# Altium project foxbms2-master.PrjPcb (part 5 of 8)

## Sheet supply.SchDoc
size A3; DocumentNumber: 41; SheetNumber: 41; SheetTotal: 45; SheetDescription: Board Power Supply
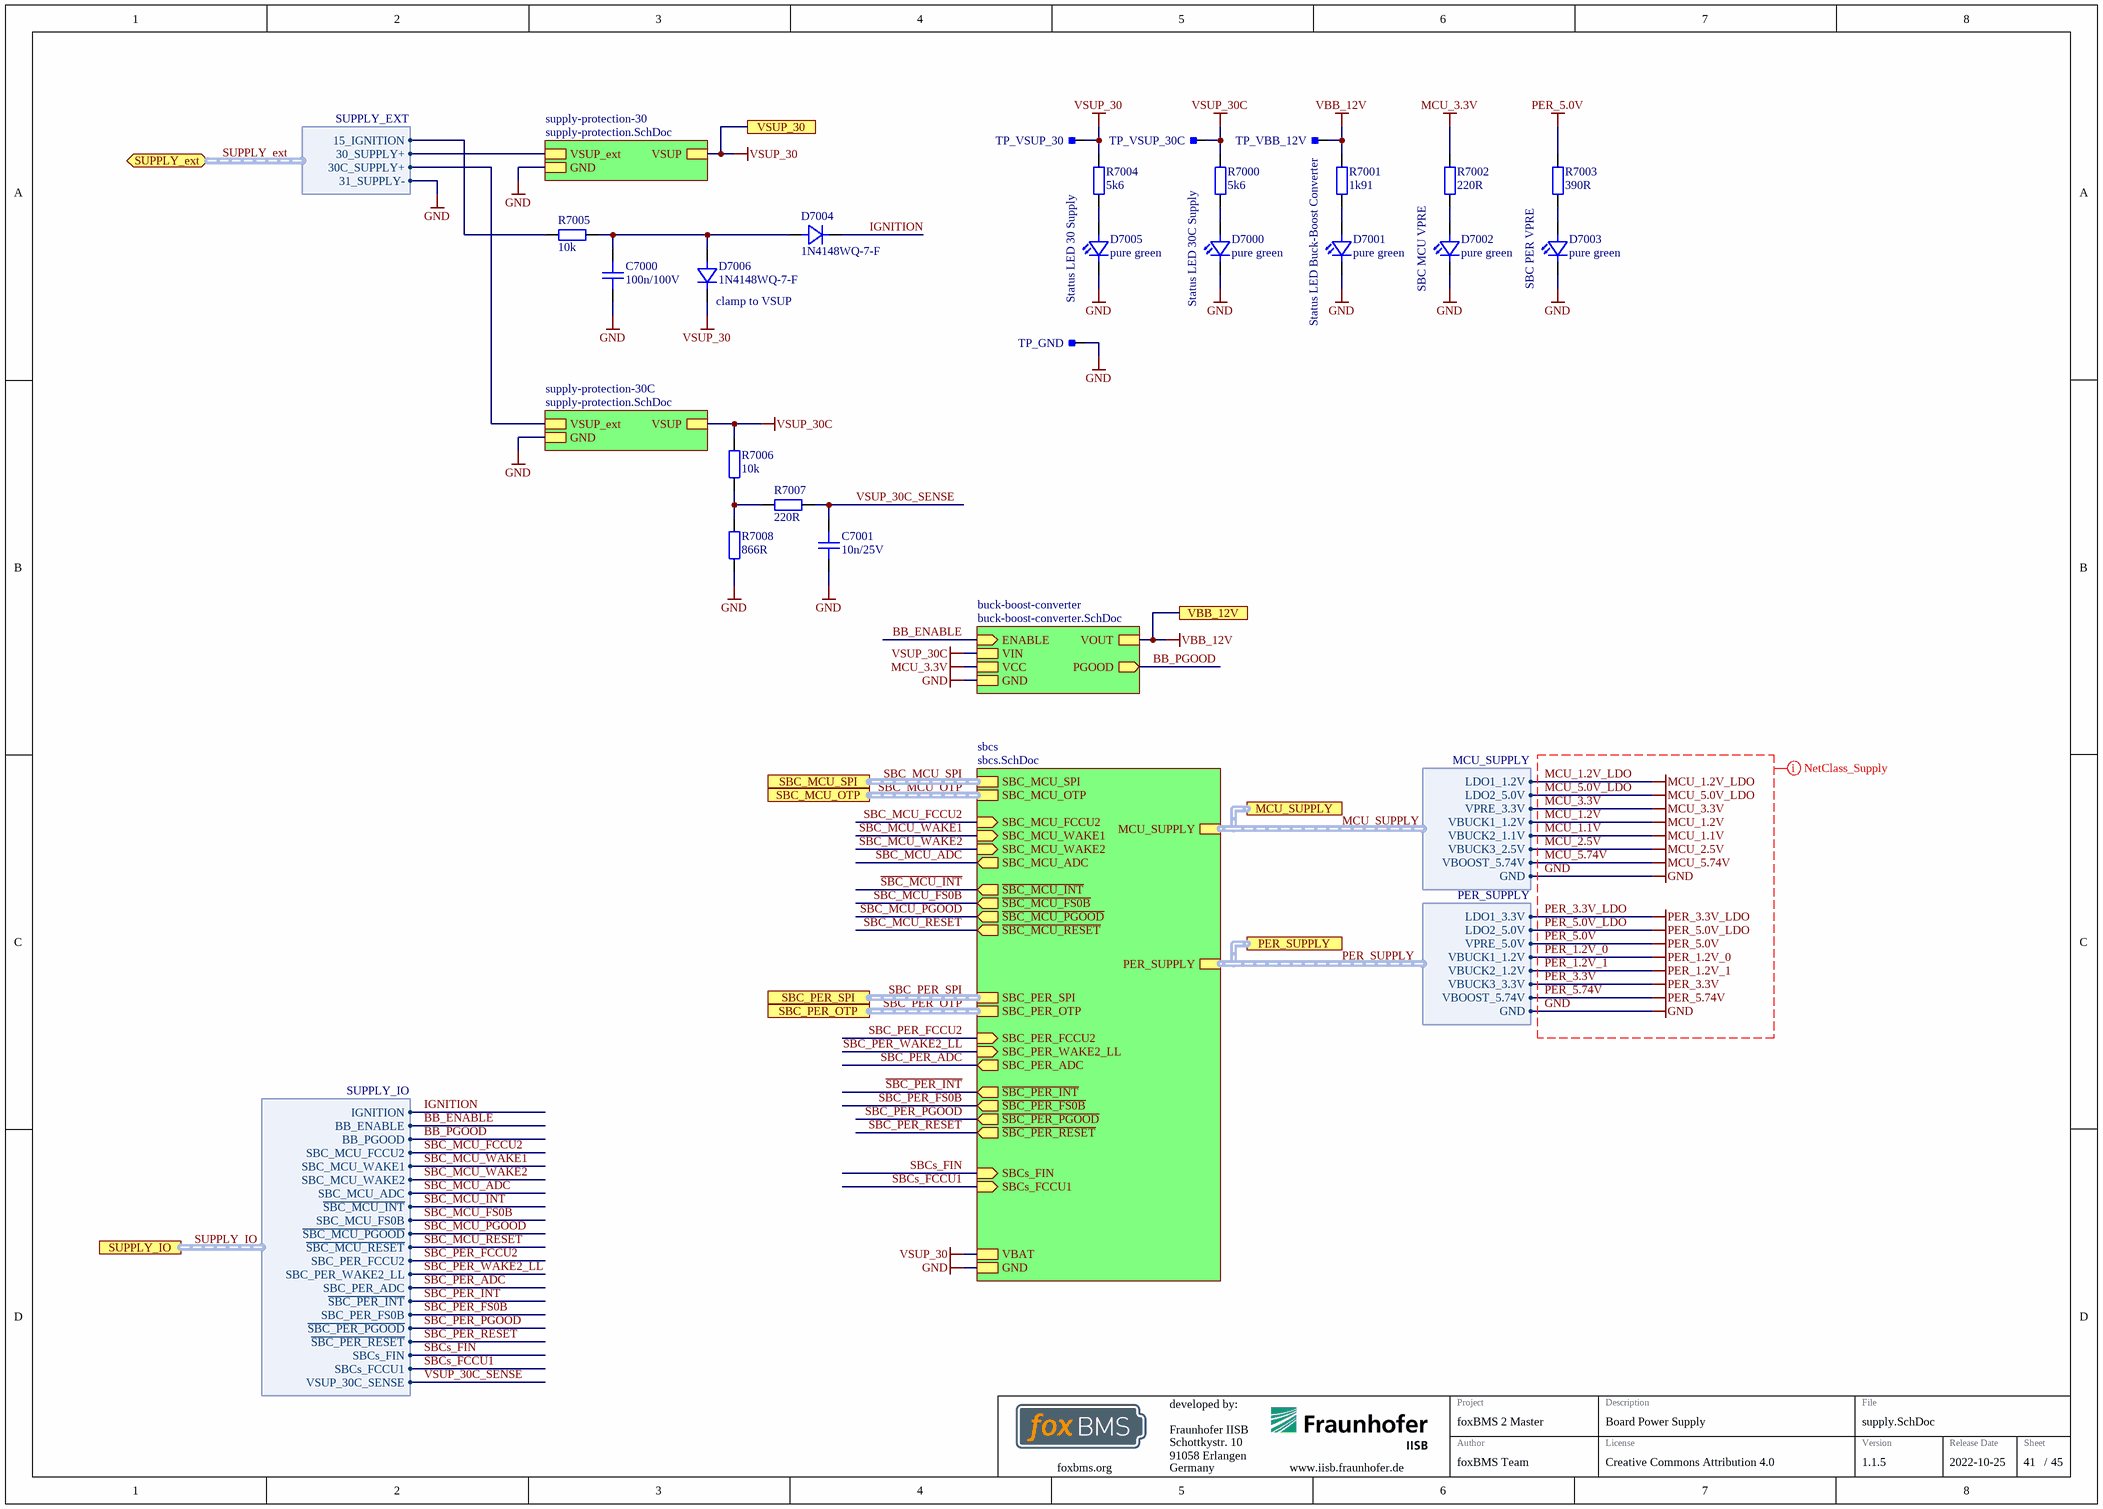
[diagram p37: supply.SchDoc]

### Parts
C7000  100n/100V  [CAPC1608X08N]
C7001  10n/25V  [CAPC1005X06N]
D7000  pure green  [LEDC1608X07N]
D7001  pure green  [LEDC1608X07N]
D7002  pure green  [LEDC1608X07N]
D7003  pure green  [LEDC1608X07N]
D7004  1N4148WQ-7-F  [SOD-123_CASE-425-04-ISSUE-G]
D7005  pure green  [LEDC1608X07N]
D7006  1N4148WQ-7-F  [SOD-123_CASE-425-04-ISSUE-G]
R7000  5k6  [RESC1005X04N]
R7001  1k91  [RESC1005X04N]
R7002  220R  [RESC1005X04N]
R7003  390R  [RESC1005X04N]
R7004  5k6  [RESC1005X04N]
R7005  10k  [RESC1005X04N]
R7006  10k  [RESC1005X04N]
R7007  220R  [RESC1005X04N]
R7008  866R  [RESC1005X04N]
TP_GND  Testpoint_Square  [Testpoint_S1]  (value not drawn)  (no BOM)
TP_VBB_12V  Testpoint_Square  [Testpoint_S1]  (value not drawn)  (no BOM)
TP_VSUP_30  Testpoint_Square  [Testpoint_S1]  (value not drawn)  (no BOM)
TP_VSUP_30C  Testpoint_Square  [Testpoint_S1]  (value not drawn)  (no BOM)

### Sub-sheets
buck-boost-converter = buck-boost-converter.SchDoc: VIN, VOUT, PGOOD (out), GND, VCC, ENABLE (in)
sbcs = sbcs.SchDoc: VBAT, GND, SBC_MCU_SPI (harness SPI), PER_SUPPLY (harness PER_SUPPLY), SBC_MCU_WAKE2 (in), SBC_PER_ADC (out), SBC_PER_OTP (harness SBC_OTP), SBC_MCU_FCCU2 (in), SBC_PER_FCCU2 (in), ~{SBC_PER_INT} (out), ~{SBC_MCU_FS0B} (out), ~{SBC_PER_FS0B} (out), SBC_MCU_ADC (out), ~{SBC_MCU_INT} (out), MCU_SUPPLY (harness MCU_SUPPLY), SBC_PER_WAKE2_LL (in), SBC_MCU_OTP (harness SBC_OTP), SBC_MCU_WAKE1 (in), SBC_PER_SPI (harness SPI), SBCs_FIN (in), ~{SBC_MCU_PGOOD} (out), ~{SBC_MCU_RESET} (out), SBCs_FCCU1 (in), ~{SBC_PER_PGOOD} (out), ~{SBC_PER_RESET} (out)
supply-protection-30 = supply-protection.SchDoc: VSUP, GND, VSUP_ext
supply-protection-30C = supply-protection.SchDoc: VSUP, GND, VSUP_ext

### Ports
MCU_SUPPLY (harness MCU_SUPPLY), PER_SUPPLY (harness PER_SUPPLY), SBC_MCU_OTP (harness SBC_OTP), SBC_MCU_SPI (harness SPI), SBC_PER_OTP (harness SBC_OTP), SBC_PER_SPI (harness SPI), SUPPLY_ext (bidir, harness SUPPLY_EXT), SUPPLY_IO (harness SUPPLY_IO), VBB_12V, VSUP_30

### Harnesses
MCU_SUPPLY: VBUCK1_1.2V, VBUCK2_1.1V, VBUCK3_2.5V, LDO1_1.2V, LDO2_5.0V, GND, VPRE_3.3V, VBOOST_5.74V
PER_SUPPLY: GND, VBOOST_5.74V, LDO1_3.3V, LDO2_5.0V, VPRE_5.0V, VBUCK1_1.2V, VBUCK2_1.2V, VBUCK3_3.3V
SUPPLY_IO: IGNITION, BB_ENABLE, BB_PGOOD, SBC_MCU_FCCU2, SBC_MCU_WAKE1, SBC_MCU_WAKE2, SBC_MCU_ADC, ~{SBC_MCU_INT}, SBC_MCU_FS0B, ~{SBC_MCU_PGOOD}, ~{SBC_MCU_RESET}, SBC_PER_FCCU2, SBC_PER_WAKE2_LL, SBC_PER_ADC, ~{SBC_PER_INT}, SBC_PER_FS0B, SBCs_FIN, SBCs_FCCU1, ~{SBC_PER_PGOOD}, ~{SBC_PER_RESET}, VSUP_30C_SENSE
SUPPLY_EXT: 30_SUPPLY+, 31_SUPPLY-, 15_IGNITION, 30C_SUPPLY+

### Nets
GND: C7000.1 C7001.1 D7000.1(C) D7001.1(C) D7002.1(C) D7003.1(C) D7005.1(C) R7008.1 TP_GND.1 ; sheet buck-boost-converter/GND, sheet supply-protection-30/GND, sheet sbcs/GND, sheet supply-protection-30C/GND, port MCU_SUPPLY.GND, port PER_SUPPLY.GND, port SUPPLY_ext.31_SUPPLY-
MCU_3.3V: R7002.2 ; sheet buck-boost-converter/VCC, port MCU_SUPPLY.VPRE_3.3V
PER_5.0V: R7003.2 ; port PER_SUPPLY.VPRE_5.0V
VBB_12V: R7001.2 TP_VBB_12V.1 ; port VBB_12V, sheet buck-boost-converter/VOUT
VSUP_30: D7006.1(K) R7004.2 TP_VSUP_30.1 ; port VSUP_30, sheet supply-protection-30/VSUP, sheet sbcs/VBAT
VSUP_30C: R7000.2 R7006.2 TP_VSUP_30C.1 ; sheet buck-boost-converter/VIN, sheet supply-protection-30C/VSUP
VSUP_ext: sheet supply-protection-30/VSUP_ext, port SUPPLY_ext.30_SUPPLY+
VSUP_ext: sheet supply-protection-30C/VSUP_ext, port SUPPLY_ext.30C_SUPPLY+  [a separate net that carries the same name]
~{SBC_MCU_INT}: sheet sbcs/~{SBC_MCU_INT}, port SUPPLY_IO.~{SBC_MCU_INT}  [project net MCU_GIOA.0]
~{SBC_MCU_PGOOD}: sheet sbcs/~{SBC_MCU_PGOOD}, port SUPPLY_IO.~{SBC_MCU_PGOOD}  [project net EXT_CON~{.}SBC_MCU_PGOOD]
~{SBC_MCU_RESET}: sheet sbcs/~{SBC_MCU_RESET}, port SUPPLY_IO.~{SBC_MCU_RESET}  [project net EXT_CON~{.}SBC_MCU_RESET]
~{SBC_PER_INT}: sheet sbcs/~{SBC_PER_INT}, port SUPPLY_IO.~{SBC_PER_INT}  [project net MCU_GIOA.1]
~{SBC_PER_PGOOD}: sheet sbcs/~{SBC_PER_PGOOD}, port SUPPLY_IO.~{SBC_PER_PGOOD}  [project net EXT_CON~{.}SBC_PER_PGOOD]
~{SBC_PER_RESET}: sheet sbcs/~{SBC_PER_RESET}, port SUPPLY_IO.~{SBC_PER_RESET}  [project net EXT_CON~{.}SBC_PER_RESET]
BB_ENABLE: sheet buck-boost-converter/ENABLE, port SUPPLY_IO.BB_ENABLE  [project net MCU_GIOX.T6]
BB_PGOOD: sheet buck-boost-converter/PGOOD, port SUPPLY_IO.BB_PGOOD  [project net MCU_GIOB.7]
IGNITION: D7004.1(K) ; sheet sbcs/SBC_MCU_WAKE1, port SUPPLY_IO.IGNITION, port SUPPLY_IO.SBC_MCU_WAKE1  [also labelled SBC_MCU_WAKE1]  [project net COM_IO.INH]
SBC_MCU_ADC: sheet sbcs/SBC_MCU_ADC, port SUPPLY_IO.SBC_MCU_ADC  [project net SUPPLY_IO.SBC_MCU_ADC]
SBC_MCU_FCCU2: sheet sbcs/SBC_MCU_FCCU2, port SUPPLY_IO.SBC_MCU_FCCU2  [project net MCU_GIOX.T7]
SBC_MCU_FS0B: sheet sbcs/~{SBC_MCU_FS0B}, port SUPPLY_IO.SBC_MCU_FS0B  [project net EXT_CON.SBC_MCU_FS0B]
SBC_MCU_WAKE2: sheet sbcs/SBC_MCU_WAKE2, port SUPPLY_IO.SBC_MCU_WAKE2  [project net PER_IO~{.}RTC_INTA_HV]
SBC_PER_ADC: sheet sbcs/SBC_PER_ADC, port SUPPLY_IO.SBC_PER_ADC  [project net SUPPLY_IO.SBC_PER_ADC]
SBC_PER_FCCU2: sheet sbcs/SBC_PER_FCCU2, port SUPPLY_IO.SBC_PER_FCCU2  [project net MCU_GIOX.T8]
SBC_PER_FS0B: sheet sbcs/~{SBC_PER_FS0B}, port SUPPLY_IO.SBC_PER_FS0B  [project net EXT_CON.SBC_PER_FS0B]
SBC_PER_WAKE2_LL: sheet sbcs/SBC_PER_WAKE2_LL, port SUPPLY_IO.SBC_PER_WAKE2_LL  [project net MCU_GIOX.N4]
SBCs_FCCU1: sheet sbcs/SBCs_FCCU1, port SUPPLY_IO.SBCs_FCCU1  [project net MCU_RST~{.}ERROR]
SBCs_FIN: sheet sbcs/SBCs_FIN, port SUPPLY_IO.SBCs_FIN  [project net MCU_CLK.2.22MHz]
SUPPLY_ext.15_IGNITION: R7005.2 ; port SUPPLY_ext.15_IGNITION
VSUP_30C_SENSE: C7001.2 R7007.2 ; port SUPPLY_IO.VSUP_30C_SENSE  [project net SUPPLY_IO.VSUP_30C_SENSE]
NetC7000_2: C7000.2 D7004.2(A) D7006.2(A) R7005.1
NetD7000_2: D7000.2(A) R7000.1
NetD7001_2: D7001.2(A) R7001.1
NetD7002_2: D7002.2(A) R7002.1
NetD7003_2: D7003.2(A) R7003.1
NetD7005_2: D7005.2(A) R7004.1
NetR7006_1: R7006.1 R7007.1 R7008.2

### Buses and harness runs
harness MCU_SUPPLY = port MCU_SUPPLY = sheet sbcs/MCU_SUPPLY
harness PER_SUPPLY = port PER_SUPPLY = sheet sbcs/PER_SUPPLY
harness SBC_MCU_OTP = port SBC_MCU_OTP = sheet sbcs/SBC_MCU_OTP
harness SBC_MCU_SPI = port SBC_MCU_SPI = sheet sbcs/SBC_MCU_SPI
harness SBC_PER_OTP = port SBC_PER_OTP = sheet sbcs/SBC_PER_OTP
harness SBC_PER_SPI = port SBC_PER_SPI = sheet sbcs/SBC_PER_SPI
harness SUPPLY_ext = port SUPPLY_ext
harness SUPPLY_IO = port SUPPLY_IO

### Layout directives
net class Supply_All: GND, MCU_1.1V, MCU_1.2V, MCU_1.2V_LDO, MCU_2.5V, MCU_3.3V, MCU_5.0V_LDO, MCU_5.74V, PER_1.2V_0, PER_1.2V_1, PER_3.3V, PER_3.3V_LDO, PER_5.0V, PER_5.0V_LDO, PER_5.74V

### Notes on the sheet
- Status LED 30 Supply
- Status LED 30C Supply
- (near TP_VBB_12V) Status LED Buck-Boost Converter
- SBC MCU VPRE
- SBC PER VPRE
- (near D7006) clamp to VSUP
- Fraunhofer IISB
- Schottkystr. 10
- developed by:
- 91058 Erlangen
- Germany
- Author
- Project
- License
- Description
- File
- Version
- Release Date
- Sheet
- foxbms.org <https://foxbms.org>
- www.iisb.fraunhofer.de <https://www.iisb.fraunhofer.de/>
- foxBMS Team
- /

### Library data of the parts
C7000 = gen_C_ceramic_100n_100V_X7R_0603: MLCC; Capacitance: 100n; Rated Voltage: 100V; Dielectric: X7R; Case EIA: 0603; Case Metric: 1608; Automotive Qualified: True; PnP Package: 0603C; Part Number: gen_C_ceramic_100n_100V_X7R_0603; Supplier 1: Digikey; Supplier Part Number 1: 490-13420-1-ND; Supplier 2: Mouser; Supplier Part Number 2: 81-GCJ188R72A104KA1D
C7001 = gen_C_ceramic_10n_25V_X7R_0402: MLCC; Capacitance: 10n; Rated Voltage: 25V; Dielectric: X7R; Case EIA: 0402; Case Metric: 1005; PnP Package: 0402C; PnP Value: 10nF/25V/X7R; PnP equipped: x; Automotive Qualified: True; Part Number: gen_C_ceramic_10n_25V_X7R_0402; Supplier 1: Farnell; Supplier Part Number 1: 2210793
D7000-D7003 D7005 = LED_0603_pure_green_AECQ: TLMP1100-GS08; Manufacturer: Vishay; Breakdown Voltage: 5V; Continuous Forward Current: 20mA; Forward Voltage @ 20mA: 2.1V; Automotive Qualified: True; Part Number: LED_0603_pure_green_AECQ; Color: pure green; Operating Temperature: -40°C - 100°C; ComponentLink1Description: Datasheet; ComponentLink1URL: http://www.farnell.com/datasheets/2049164.pdf; Supplier 1: Farnell; Supplier Part Number 1: 1328306; Supplier 2: Digikey; Supplier Part Number 2: 751-1176-1-ND; PnP Package: LED_0603
D7004 D7006 = 1N4148WQ-7-F: Diode; Manufacturer: Diodes Inc.; Breakdown Voltage: 100V; Continuous Forward Current: 300mA; PnP Package: SOD123; Automotive Qualified: True; Part Number: 1N4148WQ-7-F; Part Name: 1N4148WQ-7-F; Operating Temperature: -65°C - +150°C; ComponentLink1Description: Datasheet; ComponentLink1URL: https://www.diodes.com/assets/Datasheets/ds30086.pdf; Supplier 1: Digikey; Supplier Part Number 1: 1N4148WQ-7-FDICT-ND
R7000 R7004 = gen_R_5k6_0402: SMD Resistor 5k6 0402; Tolerance: 1%; Power: 0.063W; Case EIA: 0402; Case Metric: 1005; Maximum Working Voltage: 50V; PnP Package: 0402R; Automotive Qualified: True; AEC-Q Norm: AEC-Q200; AEC-Q Grade: Grade 0; Part Number: gen_R_5k6_0402; Operating Temperature: -55°C - +155°C; Resistance: 5k6; Series: E24; PnP Value: 5k6; Supplier 1: Digikey; Supplier Part Number 1: A129636CT-ND; ECCN: EAR99
R7001 = gen_R_1k91_0402: SMD Resistor 1k91 0402; Tolerance: 1%; Power: 0.063W; Case EIA: 0402; Case Metric: 1005; Maximum Working Voltage: 50V; PnP Package: 0402R; Automotive Qualified: True; AEC-Q Grade: Grade 0; AEC-Q Norm: AEC-Q200; Part Number: gen_R_1k91_0402; Operating Temperature: -55°C - +155°C; Resistance: 1k91; Series: E96; PnP Value: 1k91; ECCN: EAR99; Supplier 1: Digikey; Supplier Part Number 1: P1.91KLCT-ND
R7002 = gen_R_220R_0402: SMD Resistor 220R 0402; Tolerance: 1%; Power: 0.063W; Case EIA: 0402; Case Metric: 1005; Maximum Working Voltage: 50V; PnP Package: 0402R; Automotive Qualified: True; AEC-Q Norm: AEC-Q200; AEC-Q Grade: Grade 0; Part Number: gen_R_220R_0402; Operating Temperature: -55°C - +155°C; Resistance: 220R; Series: E24; PnP Value: 220R; Supplier 1: Digikey; Supplier Part Number 1: A129619CT-ND; ECCN: EAR99
R7003 = gen_R_390R_0402: SMD Resistor 390R 0402; Tolerance: 1%; Power: 0.063W; Case EIA: 0402; Case Metric: 1005; Maximum Working Voltage: 50V; PnP Package: 0402R; Automotive Qualified: True; AEC-Q Grade: Grade 0; AEC-Q Norm: AEC-Q200; Part Number: gen_R_390R_0402; Operating Temperature: -55°C - +155°C; Resistance: 390R; Series: E24; PnP Value: 390R; ECCN: EAR99; Supplier 1: Farnell; Supplier Part Number 1: 2563565
R7005 = gen_R_10k_0402: SMD Resistor 10k 0402; Tolerance: 1%; Power: 0.063W; Case EIA: 0402; Case Metric: 1005; Maximum Working Voltage: 50V; PnP Package: 0402R; PnP equipped: x; Automotive Qualified: True; AEC-Q Norm: AEC-Q200; Part Number: gen_R_10k_0402; Operating Temperature: -55°C - +155°C; Resistance: 10k; Series: E24, E96; PnP Value: 10k; Supplier 1: Farnell; Supplier Part Number 1: 2059239; ECCN: EAR99
R7006 = gen_R_10k_0402: SMD Resistor 10k 0402; Tolerance: 1%; Power: 0.063W; Case EIA: 0402; Case Metric: 1005; Maximum Working Voltage: 50V; PnP Package: 0402R; Automotive Qualified: True; AEC-Q Norm: AEC-Q200; PnP equipped: x; Part Number: gen_R_10k_0402; Operating Temperature: -55°C - +155°C; Resistance: 10k; Series: E24, E96; PnP Value: 10k; ECCN: EAR99; Supplier 1: Farnell; Supplier Part Number 1: 2059239
R7007 = gen_R_220R_0402: SMD Resistor 220R 0402; Tolerance: 1%; Power: 0.063W; Case EIA: 0402; Case Metric: 1005; Maximum Working Voltage: 50V; PnP Package: 0402R; Automotive Qualified: True; AEC-Q Grade: Grade 0; AEC-Q Norm: AEC-Q200; Part Number: gen_R_220R_0402; Operating Temperature: -55°C - +155°C; Resistance: 220R; Series: E24; PnP Value: 220R; ECCN: EAR99; Supplier 1: Digikey; Supplier Part Number 1: A129619CT-ND
R7008 = gen_R_866R_0402: SMD Resistor 866R 0402; Tolerance: 1%; Power: 0.063W; Case EIA: 0402; Case Metric: 1005; Maximum Working Voltage: 50V; PnP Package: 0402R; Automotive Qualified: True; AEC-Q Grade: Grade 0; AEC-Q Norm: AEC-Q200; Part Number: gen_R_866R_0402; Operating Temperature: -55°C - +155°C; Resistance: 866R; Series: E96; PnP Value: 866R; ECCN: EAR99; Supplier 1: Farnell; Supplier Part Number 1: 2302631
TP_GND TP_VBB_12V TP_VSUP_30 TP_VSUP_30C = Testpoint_Square: Testpoint, square; Automotive Qualified: False; Part Number: Testpoint_Square

## Sheet buck-boost-converter.SchDoc
size A3; DocumentNumber: 42; SheetNumber: 42; SheetTotal: 45; SheetDescription: Buck-boost Converter
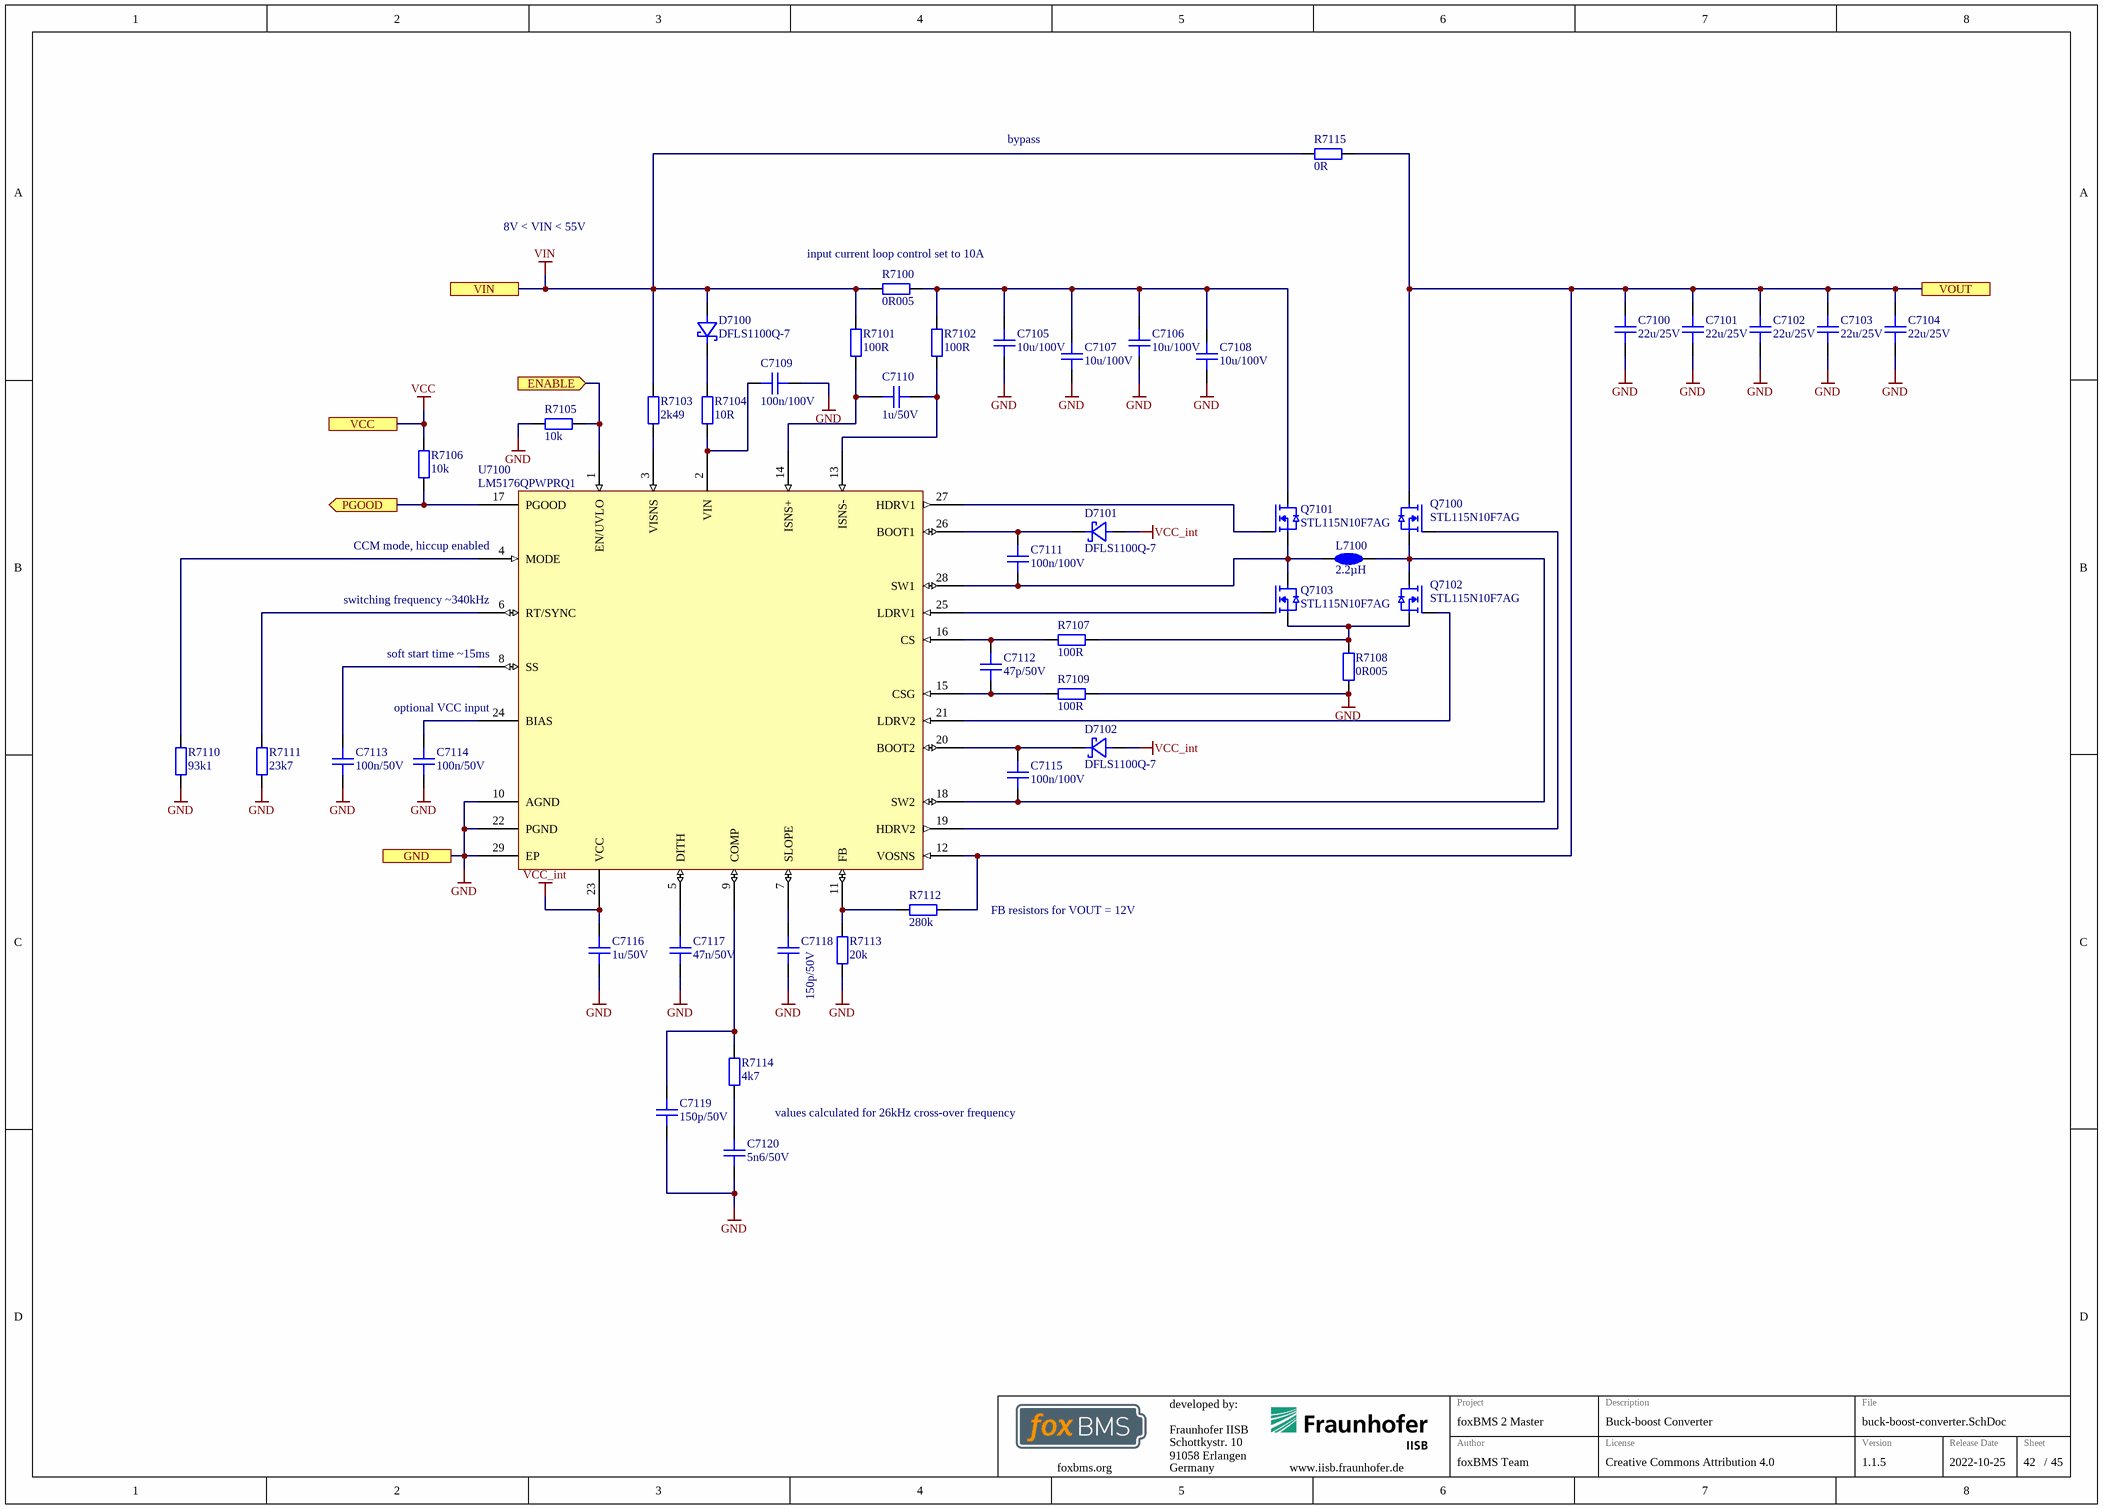
[diagram p38: buck-boost-converter.SchDoc]

### Parts
C7100  22u/25V  [CAPC3225X25N]
C7101  22u/25V  [CAPC3225X25N]
C7102  22u/25V  [CAPC3225X25N]
C7103  22u/25V  [CAPC3225X25N]
C7104  22u/25V  [CAPC3225X25N]
C7105  10u/100V  [CAPC5750X28N]
C7106  10u/100V  [CAPC5750X28N]
C7107  10u/100V  [CAPC5750X28N]
C7108  10u/100V  [CAPC5750X28N]
C7109  100n/100V  [CAPC1608X08N]
C7110  1u/50V  [CAPC1608X08N]
C7111  100n/100V  [CAPC1608X08N]
C7112  47p/50V  [CAPC1005X06N]
C7113  100n/50V  [CAPC1005X06N]
C7114  100n/50V  [CAPC1005X06N]
C7115  100n/100V  [CAPC1608X08N]
C7116  1u/50V  [CAPC1608X08N]
C7117  47n/50V  [CAPC1005X06N]
C7118  150p/50V  [CAPC1005X06N]
C7119  150p/50V  [CAPC1005X06N]
C7120  5n6/50V  [CAPC1608X08N]
D7100  DFLS1100Q-7  [PowerDI123]
D7101  DFLS1100Q-7  [PowerDI123]
D7102  DFLS1100Q-7  [PowerDI123]
L7100  2.2µH  [COILCRAFT_XAL1010]
Q7100  STL115N10F7AG  [ST_PowerFLAT_5x6_WF_type_C]
Q7101  STL115N10F7AG  [ST_PowerFLAT_5x6_WF_type_C]
Q7102  STL115N10F7AG  [ST_PowerFLAT_5x6_WF_type_C]
Q7103  STL115N10F7AG  [ST_PowerFLAT_5x6_WF_type_C]
R7100  0R005  [PANASONIC_ERJMS4H]
R7101  100R  [RESC1005X04N]
R7102  100R  [RESC1005X04N]
R7103  2k49  [RESC1005X04N]
R7104  10R  [RESC1005X04N]
R7105  10k  [RESC1005X04N]
R7106  10k  [RESC1005X04N]
R7107  100R  [RESC1005X04N]
R7108  0R005  [PANASONIC_ERJMS4H]
R7109  100R  [RESC1005X04N]
R7110  93k1  [RESC1005X04N]
R7111  23k7  [RESC1005X04N]
R7112  280k  [RESC1005X04N]
R7113  20k  [RESC1005X04N]
R7114  4k7  [RESC1005X04N]
R7115  0R  [RESC6331X07N]
U7100  LM5176QPWPRQ1  [LM5176-PWP]

### Ports
ENABLE (in), GND, PGOOD (out), VCC, VIN, VOUT

### Nets
GND: C7100.1 C7101.1 C7102.1 C7103.1 C7104.1 C7105.1 C7106.1 C7107.1 C7108.1 C7109.1 C7113.2 C7114.2 C7116.2 C7117.1 C7118.1 C7119.1 C7120.1 R7105.2 R7108.1 R7109.1 R7110.1 R7111.1 R7113.1 U7100.10(AGND) U7100.22(PGND) U7100.29(EP) ; port GND
VBB_12V: C7100.2 C7101.2 C7102.2 C7103.2 C7104.2 Q7100.D R7112.1 R7115.2 U7100.12(VOSNS) ; port VOUT
VCC: R7106.2 ; port VCC  [project net MCU_3.3V]
VCC_int: C7116.1 D7101.2(A) D7102.2(A) U7100.23(VCC)
VIN: D7100.2(A) R7100.1 R7101.2 R7103.2 R7115.1 ; port VIN  [project net VSUP_30C]
MCU_GIOB.7: R7106.1 U7100.17(PGOOD) ; port PGOOD
MCU_GIOX.T6: R7105.1 U7100.1(EN/UVLO) ; port ENABLE
NetC7105_2: C7105.2 C7106.2 C7107.2 C7108.2 Q7101.D R7100.2 R7102.2
NetC7109_2: C7109.2 R7104.1 U7100.2(VIN)
NetC7110_1: C7110.1 R7102.1 U7100.13(ISNS-)
NetC7110_2: C7110.2 R7101.1 U7100.14(ISNS+)
NetC7111_1: C7111.1 D7101.1(K) U7100.26(BOOT1)
NetC7111_2: C7111.2 L7100.1 Q7101.S Q7103.D U7100.28(SW1)
NetC7112_1: C7112.1 R7109.2 U7100.15(CSG)
NetC7112_2: C7112.2 R7107.2 U7100.16(CS)
NetC7113_1: C7113.1 U7100.8(SS)
NetC7114_1: C7114.1 U7100.24(BIAS)
NetC7115_1: C7115.1 D7102.1(K) U7100.20(BOOT2)
NetC7115_2: C7115.2 L7100.2 Q7100.S Q7102.D U7100.18(SW2)
NetC7117_2: C7117.2 U7100.5(DITH)
NetC7118_2: C7118.2 U7100.7(SLOPE)
NetC7119_2: C7119.2 R7114.2 U7100.9(COMP)
NetC7120_2: C7120.2 R7114.1
NetD7100_1: D7100.1(K) R7104.2
NetQ7100_G: Q7100.G U7100.19(HDRV2)
NetQ7101_G: Q7101.G U7100.27(HDRV1)
NetQ7102_G: Q7102.G U7100.21(LDRV2)
NetQ7102_S: Q7102.S Q7103.S R7107.1 R7108.2
NetQ7103_G: Q7103.G U7100.25(LDRV1)
NetR7103_1: R7103.1 U7100.3(VISNS)
NetR7110_2: R7110.2 U7100.4(MODE)
NetR7111_2: R7111.2 U7100.6(RT/SYNC)
NetR7112_2: R7112.2 R7113.2 U7100.11(FB)

### Notes on the sheet
- bypass
- 8V < VIN < 55V
- (near R7100) input current loop control set to 10A
- (near U7100) CCM mode, hiccup enabled
- (near U7100) switching frequency ~340kHz
- (near U7100) soft start time ~15ms
- optional VCC input
- FB resistors for VOUT = 12V
- values calculated for 26kHz cross-over frequency
- Fraunhofer IISB
- Schottkystr. 10
- developed by:
- 91058 Erlangen
- Germany
- Author
- Project
- License
- Description
- File
- Version
- Release Date
- Sheet
- foxbms.org <https://foxbms.org>
- www.iisb.fraunhofer.de <https://www.iisb.fraunhofer.de/>
- foxBMS Team
- /

### Library data of the parts
C7100-C7104 = gen_C_ceramic_22u_25V_X7R_1210: MLCC; Capacitance: 22u; Rated Voltage: 25V; Dielectric: X7R; Case EIA: 1210; Case Metric: 3225; Automotive Qualified: True; Part Number: gen_C_ceramic_22u_25V_X7R_1210; Supplier 1: Digikey; Supplier Part Number 1: 445-180363-1-ND
C7105-C7108 = gen_C_ceramic_10u_100V_X7S_2220: MLCC; Capacitance: 10u; Rated Voltage: 100V; Dielectric: X7S; Case EIA: 2220; Case Metric: 5750; Automotive Qualified: True; AEC-Q Grade: Grade 0; AEC-Q Norm: AEC-Q200; Part Number: gen_C_ceramic_10u_100V_X7S_2220; Supplier 1: Digikey; Supplier Part Number 1: 445-13152-1-ND; ECCN: EAR99
C7109 C7111 C7115 = gen_C_ceramic_100n_100V_X7R_0603: as C7000 on sheet supply; Part Number: gen_C_ceramic_100n_100V_X7R_0603; Supplier 1: Digikey; Supplier Part Number 1: 490-13420-1-ND; Supplier 2: Mouser; Supplier Part Number 2: 81-GCJ188R72A104KA1D
C7110 C7116 = gen_C_ceramic_1u_50V_X7R_0603: MLCC; Capacitance: 1u; Rated Voltage: 50V; Dielectric: X7R; Tolerance: ± 10%; Case EIA: 0603; Case Metric: 1608; Automotive Qualified: False; PnP Package: 0603C; Part Number: gen_C_ceramic_1u_50V_X7R_0603; Operating Temperature: -55°C - +125°C; Supplier 1: Farnell; Supplier Part Number 1: 2779055
C7112 = gen_C_ceramic_47p_50V_C0G_0402: MLCC; Capacitance: 47p; Rated Voltage: 50V; Dielectric: C0G; Case EIA: 0402; Case Metric: 1005; Automotive Qualified: True; PnP Package: 0402C; Part Number: gen_C_ceramic_47p_50V_C0G_0402; Supplier 1: Digikey; Supplier Part Number 1: 490-10670-1-ND
C7113 C7114 = gen_C_ceramic_100n_50V_X7R_0402: MLCC; Capacitance: 100n; Rated Voltage: 50V; Dielectric: X7R; Case EIA: 0402; Case Metric: 1005; Automotive Qualified: True; PnP Package: 0402C; PnP Value: 100nF/50V/X7R; PnP equipped: x; AEC-Q Norm: AEC-Q200; Part Number: gen_C_ceramic_100n_50V_X7R_0402; Supplier 1: Farnell; Supplier Part Number 1: 2210822; ECCN: EAR99
C7117 = gen_C_ceramic_47n_50V_X7R_0402: MLCC; Capacitance: 47n; Rated Voltage: 50V; Dielectric: X7R; Case EIA: 0402; Case Metric: 1005; Automotive Qualified: True; PnP Package: 0402C; Part Number: gen_C_ceramic_47n_50V_X7R_0402; Supplier 1: Farnell; Supplier Part Number 1: 2210827
C7118 C7119 = gen_C_ceramic_150p_50V_C0G_0402: MLCC; Capacitance: 150p; Rated Voltage: 50V; Dielectric: C0G; Case EIA: 0402; Case Metric: 1005; Automotive Qualified: True; PnP Package: 0402C; Part Number: gen_C_ceramic_150p_50V_C0G_0402; Supplier 1: Digikey; Supplier Part Number 1: 490-4926-1-ND
C7120 = gen_C_ceramic_5n6_50V_C0G_0603: MLCC; Capacitance: 5n6; Rated Voltage: 50V; Dielectric: C0G; Case EIA: 0603; Case Metric: 1608; Automotive Qualified: True; PnP Package: 0603C; Part Number: gen_C_ceramic_5n6_50V_C0G_0603; Supplier 1: Farnell; Supplier Part Number 1: 2210857
D7100-D7102 = DFLS1100Q-7: Schottky Diode; Manufacturer: Diodes Inc.; Breakdown Voltage: 100V; Continuous Forward Current: 1A; Automotive Qualified: True; Part Number: DFLS1100Q-7; Part Name: DFLS1100Q-7; Operating Temperature: −55°C - +175°C; ComponentLink1Description: Datasheet; ComponentLink1URL: https://www.diodes.com/assets/Datasheets/ds30497.pdf; Supplier 1: Mouser; Supplier Part Number 1: 621-DFLS1-100Q-7; Supplier 2: Digikey; Supplier Part Number 2: DFLS1100Q-7DICT-ND; Supplier 3: Farnell; Supplier Part Number 3: 3127293; PnP Package: POWERDI123
L7100 = XAL1010-222MEB: Power Inductor; Manufacturer: Coilcraft; Rated Current: 24.5A; Saturation Current: 34A; Automotive Qualified: True; Part Number: XAL1010-222MEB; Operating Temperature: -40°C - +125°C; ComponentLink1Description: Datasheet; ComponentLink1URL: http://www.coilcraft.com/pdfs/xal1010.pdf; Inductance: 2.2µH; Supplier 1: Mouser; Supplier Part Number 1: 994-XAL1010-222MEB
Q7100-Q7103 = STL115N10F7AG: N-Channel MOSFET, 100 V, 107 A, 5 mOhm; Manufacturer: STMicroelectronics; Maximum Drain-Source Voltage: 100V; Maximum Continous Drain Current (25°C): 107A; R_DS(on): 5m; Total Gate Charge: 72.5nC; Automotive Qualified: True; AEC-Q Norm: AEC-Q101; AEC-Q Grade: Grade 0; Part Number: STL115N10F7AG; Part Name: NMOS; Operating Temperature: -55°C - +175°C; ComponentLink1Description: Datasheet; ComponentLink1URL: https://www.mouser.de/datasheet/2/389/dm00333356-1798814.pdf; Supplier 1: Mouser; Supplier Part Number 1: 511-STL115N10F7AG; Supplier 2: Digikey; Supplier Part Number 2: 497-17622-1-ND; ECCN: EAR99
R7100 R7108 = ERJ-MS4HF5M0U: SMD Shunt Resistor 0R005; Tolerance: 1%; Power: 3W; Case EIA: 2512; Automotive Qualified: True; Part Number: ERJ-MS4HF5M0U; Operating Temperature: -65°C - +170°C; Resistance: 0R005; Supplier 1: Digikey; Supplier Part Number 1: P17093CT-ND
R7101 R7102 R7107 R7109 = gen_R_100R_0402: SMD Resistor 100R 0402; Tolerance: 1%; Power: 0.063W; Case EIA: 0402; Case Metric: 1005; Maximum Working Voltage: 50V; PnP Package: 0402R; PnP equipped: x; Automotive Qualified: True; AEC-Q Norm: AEC-Q200; Part Number: gen_R_100R_0402; Operating Temperature: -55°C - +155°C; Resistance: 100R; Series: E24, E96; PnP Value: 100R; Supplier 1: Farnell; Supplier Part Number 1: 2302528; ECCN: EAR99
R7103 = gen_R_2k49_0402: SMD Resistor 2k49 0402; Tolerance: 1%; Power: 0.063W; Case EIA: 0402; Case Metric: 1005; Maximum Working Voltage: 50V; PnP Package: 0402R; Automotive Qualified: True; Part Number: gen_R_2k49_0402; Operating Temperature: -55°C - +155°C; Resistance: 2k49; Series: E96; PnP Value: 2k49; Supplier 1: Farnell; Supplier Part Number 1: 2059135
R7104 = gen_R_10R_0402: SMD Resistor 10R 0402; Tolerance: 1%; Power: 0.063W; Case EIA: 0402; Case Metric: 1005; Maximum Working Voltage: 50V; PnP Package: 0402R; Automotive Qualified: True; Part Number: gen_R_10R_0402; Operating Temperature: -55°C - +155°C; Resistance: 10R; Series: E24, E96; PnP Value: 10R; Supplier 1: Farnell; Supplier Part Number 1: 2302417
R7105 R7106 = gen_R_10k_0402: as R7005 on sheet supply; Part Number: gen_R_10k_0402; Operating Temperature: -55°C - +155°C; Resistance: 10k; Series: E24, E96; PnP Value: 10k; Supplier 1: Farnell; Supplier Part Number 1: 2059239; ECCN: EAR99
R7110 = gen_R_93k1_0402: SMD Resistor 93k1 0402; Tolerance: 1%; Power: 0.063W; Case EIA: 0402; Case Metric: 1005; Maximum Working Voltage: 50V; PnP Package: 0402R; Automotive Qualified: True; AEC-Q Grade: Grade 0; AEC-Q Norm: AEC-Q200; Part Number: gen_R_93k1_0402; Operating Temperature: -55°C - +155°C; Resistance: 93k1; Series: E96; PnP Value: 93k1; ECCN: EAR99; Supplier 1: Farnell; Supplier Part Number 1: 2302836
R7111 = gen_R_23k7_0402: SMD Resistor 23k7 0402; Tolerance: 1%; Power: 0.063W; Case EIA: 0402; Case Metric: 1005; Maximum Working Voltage: 50V; PnP Package: 0402R; Automotive Qualified: True; AEC-Q Grade: Grade 0; AEC-Q Norm: AEC-Q200; Part Number: gen_R_23k7_0402; Operating Temperature: -55°C - +155°C; Resistance: 23k7; Series: E96; PnP Value: 23k7; ECCN: EAR99; Supplier 1: Farnell; Supplier Part Number 1: 2302775
R7112 = gen_R_280k_0402: SMD Resistor 280k 0402; Tolerance: 1%; Power: 0.063W; Case EIA: 0402; Case Metric: 1005; Maximum Working Voltage: 50V; PnP Package: 0402R; Automotive Qualified: True; AEC-Q Grade: Grade 0; AEC-Q Norm: AEC-Q200; Part Number: gen_R_280k_0402; Operating Temperature: -55°C - +155°C; Resistance: 280k; Series: E96; PnP Value: 280k; ECCN: EAR99; Supplier 1: Farnell; Supplier Part Number 1: 2302887
R7113 = gen_R_20k_0402: SMD Resistor 20k 0402; Tolerance: 1%; Power: 0.063W; Case EIA: 0402; Case Metric: 1005; Maximum Working Voltage: 50V; PnP Package: 0402R; PnP equipped: x; Automotive Qualified: True; AEC-Q Norm: AEC-Q200; Part Number: gen_R_20k_0402; Operating Temperature: -55°C - +155°C; Resistance: 20k; Series: E24, E96; PnP Value: 20k; Supplier 1: Farnell; Supplier Part Number 1: 2059242; Supplier 2: Farnell; Supplier Part Number 2: 2059160; ECCN: EAR99
R7114 = gen_R_4k7_0402: SMD Resistor 4k7 0402; Tolerance: 1%; Power: 0.063W; Case EIA: 0402; Case Metric: 1005; Maximum Working Voltage: 50V; PnP Package: 0402R; Automotive Qualified: True; PnP equipped: x; Part Number: gen_R_4k7_0402; Operating Temperature: -55°C - +155°C; Resistance: 4k7; Series: E24; PnP Value: 4k7; Supplier 1: Farnell; Supplier Part Number 1: 2302707
R7115 = gen_R_0R_2512: SMD Resistor 0R 2512; Power: 1W; Case EIA: 2512; Case Metric: 6432; Maximum Working Voltage: 500V; PnP Package: 2512R; Automotive Qualified: True; Part Number: gen_R_0R_2512; Operating Temperature: -55°C - +155°C; Resistance: 0R; Series: Jumper; PnP Value: 0R; Supplier 1: Farnell; Supplier Part Number 1: 2309110
U7100 = LM5176QPWPRQ1: 55-V wide VIN synchronous 4-switch buck-boost controller; Manufacturer: Texas Instruments; PnP Package: HTSSOP-28; Automotive Qualified: True; Part Number: LM5176QPWPRQ1; Part Name: LM5176QPWPRQ1; Operating Temperature: −40°C - +125°C; ComponentLink1Description: Datasheet; ComponentLink1URL: http://www.ti.com/lit/ds/symlink/lm5176-q1.pdf; Supplier 1: Mouser; Supplier Part Number 1: 595-LM5176QPWPRQ1

## Sheet supply-protection.SchDoc
size A3; DocumentNumber: 45; SheetNumber: 45; SheetTotal: 45; SheetDescription: Power Supply Protection
Used 2 times, as channels supply/supply-protection-30, supply/supply-protection-30C. Parts and nets are listed once, with the designators drawn on the sheet.
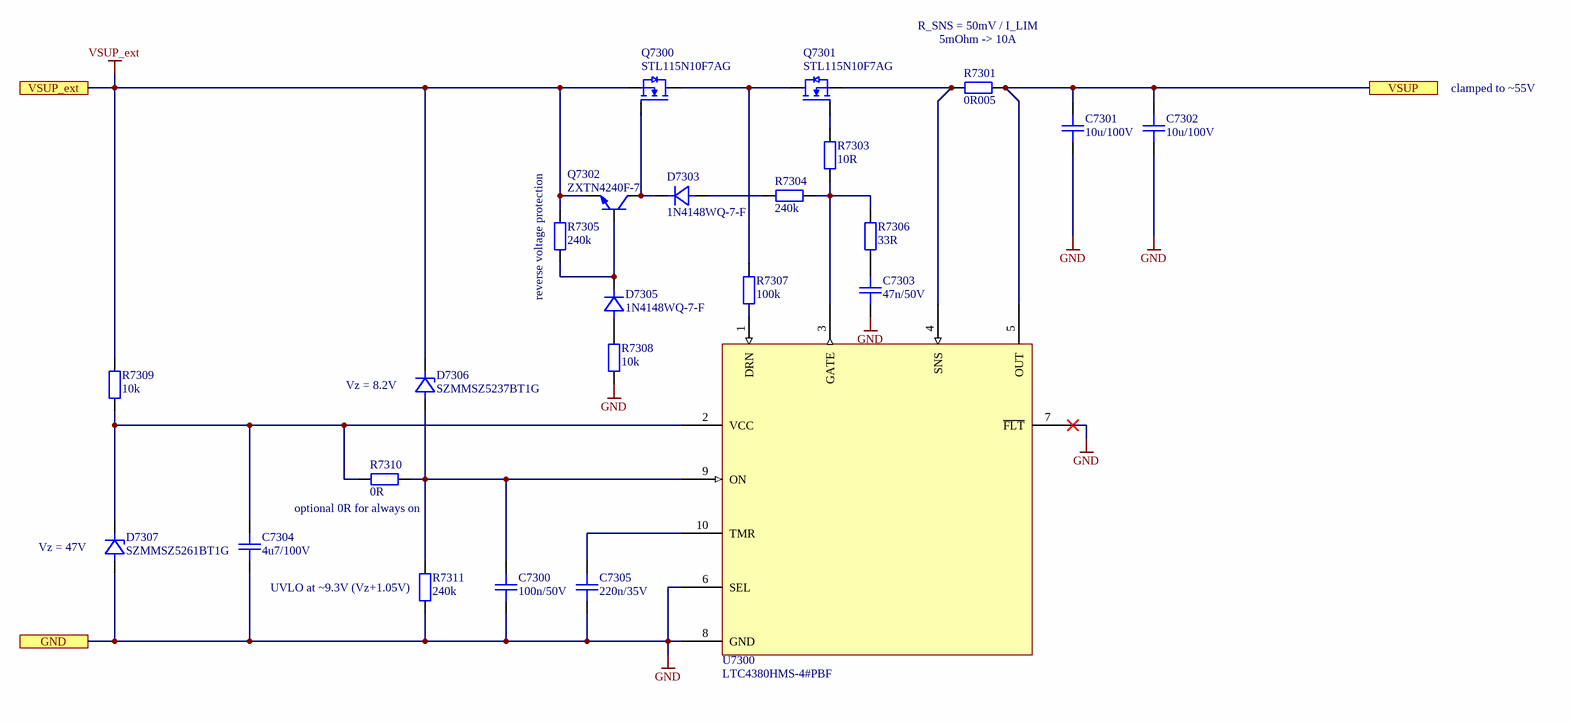
[diagram p39: supply-protection.SchDoc]

### Parts
C7300  100n/50V  [CAPC1005X06N]
C7301  10u/100V  [CAPC5750X28N]
C7302  10u/100V  [CAPC5750X28N]
C7303  47n/50V  [CAPC1005X06N]
C7304  4u7/100V  [CAPC3225X25N]
C7305  220n/35V  [CAPC1005X06N]
D7303  1N4148WQ-7-F  [SOD-123_CASE-425-04-ISSUE-G]
D7305  1N4148WQ-7-F  [SOD-123_CASE-425-04-ISSUE-G]
D7306  SZMMSZ5237BT1G  [SOD-123_CASE-425-04-ISSUE-G]
D7307  SZMMSZ5261BT1G  [SOD-123_CASE-425-04-ISSUE-G]
Q7300  STL115N10F7AG  [ST_PowerFLAT_5x6_WF_type_C]
Q7301  STL115N10F7AG  [ST_PowerFLAT_5x6_WF_type_C]
Q7302  ZXTN4240F-7  [DIODES_SOT23_NPN]
R7301  0R005  [PANASONIC_ERJMS4H]
R7303  10R  [RESC1005X04N]
R7304  240k  [RESC1005X04N]
R7305  240k  [RESC1005X04N]
R7306  33R  [RESC1005X04N]
R7307  100k  [RESC1005X04N]
R7308  10k  [RESC1005X04N]
R7309  10k  [RESC1005X04N]
R7310  0R  [RESC1005X04N]
R7311  240k  [RESC1005X04N]
U7300  LTC4380HMS-4#PBF  [LTC4380-MSOP10]

### Ports
GND, VSUP, VSUP_ext

### Nets
GND: C7300.2 C7301.1 C7302.1 C7303.1 C7304.1 C7305.1 D7307.2(A) R7308.1 R7311.1 U7300.6(SEL) U7300.7(~{FLT}) U7300.8(GND) ; port GND
VSUP_ext: D7306.1(K) Q7300.S Q7302.E R7305.2 R7309.2 ; port VSUP_ext
VSUP: C7301.2 C7302.2 R7301.2 U7300.5(OUT) ; port VSUP
NetC7300_1: C7300.1 D7306.2(A) R7310.1 R7311.2 U7300.9(ON)
NetC7303_2: C7303.2 R7306.1
NetC7304_2: C7304.2 D7307.1(K) R7309.1 R7310.2 U7300.2(VCC)
NetC7305_2: C7305.2 U7300.10(TMR)
NetD7303_1: D7303.1(K) Q7300.G Q7302.C
NetD7303_2: D7303.2(A) R7304.2
NetD7305_1: D7305.1(K) Q7302.B R7305.1
NetD7305_2: D7305.2(A) R7308.2
NetQ7300_D: Q7300.D Q7301.D R7307.2
NetQ7301_G: Q7301.G R7303.2
NetQ7301_S: Q7301.S R7301.1 U7300.4(SNS)
NetR7303_1: R7303.1 R7304.1 R7306.2 U7300.3(GATE)
NetR7307_1: R7307.1 U7300.1(DRN)

### Channels
supply/supply-protection-30: designators end in _1; ports GND=GND VSUP=VSUP_30 VSUP_ext=VSUP_ext
supply/supply-protection-30C: designators end in _2; ports GND=GND VSUP=VSUP_30C VSUP_ext=VSUP_ext

### Notes on the sheet
- R_SNS = 50mV / I_LIM
- (near R7301) 5mOhm -> 10A
- clamped to ~55V
- (near R7305) reverse voltage protection
- (near D7306) Vz = 8.2V
- (near R7310) optional 0R for always on
- (near D7307) Vz = 47V
- (near R7311) UVLO at ~9.3V (Vz+1.05V)
- Fraunhofer IISB
- Schottkystr. 10
- developed by:
- 91058 Erlangen
- Germany
- Author
- Project
- License
- Description
- File
- Version
- Release Date
- Sheet
- foxbms.org <https://foxbms.org>
- www.iisb.fraunhofer.de <https://www.iisb.fraunhofer.de/>
- foxBMS Team
- /

### Library data of the parts
C7300 = gen_C_ceramic_100n_50V_X7R_0402: as C7113 on sheet buck-boost-converter; Part Number: gen_C_ceramic_100n_50V_X7R_0402; Supplier 1: Farnell; Supplier Part Number 1: 2210822; ECCN: EAR99
C7301 C7302 = gen_C_ceramic_10u_100V_X7S_2220: as C7105-C7108 on sheet buck-boost-converter; Part Number: gen_C_ceramic_10u_100V_X7S_2220; Supplier 1: Digikey; Supplier Part Number 1: 445-13152-1-ND; ECCN: EAR99
C7303 = gen_C_ceramic_47n_50V_X7R_0402: as C7117 on sheet buck-boost-converter; Part Number: gen_C_ceramic_47n_50V_X7R_0402; Supplier 1: Farnell; Supplier Part Number 1: 2210827
C7304 = gen_C_ceramic_4u7_100V_X7S_1210: MLCC; Capacitance: 4u7; Rated Voltage: 100V; Dielectric: X7S; Case EIA: 1210; Case Metric: 3225; PnP Package: 1210C; Automotive Qualified: True; Part Number: gen_C_ceramic_4u7_100V_X7S_1210; Supplier 1: Farnell; Supplier Part Number 1: 2211140; Supplier 2: Farnell; Supplier Part Number 2: 2464634
C7305 = gen_C_ceramic_220n_35V_X7R_0402: MLCC; Capacitance: 220n; Rated Voltage: 35V; Dielectric: X7R; Case EIA: 0402; Case Metric: 1005; Automotive Qualified: True; AEC-Q Grade: Grade 1; AEC-Q Norm: AEC-Q200; PnP Package: 0402C; Part Number: gen_C_ceramic_220n_35V_X7R_0402; ECCN: EAR99; Supplier 1: Digikey; Supplier Part Number 1: 445-173767-1-ND
D7303 D7305 = 1N4148WQ-7-F: as D7004 on sheet supply; Part Number: 1N4148WQ-7-F; Part Name: 1N4148WQ-7-F; Operating Temperature: -65°C - +150°C; ComponentLink1Description: Datasheet; ComponentLink1URL: https://www.diodes.com/assets/Datasheets/ds30086.pdf; Supplier 1: Digikey; Supplier Part Number 1: 1N4148WQ-7-FDICT-ND
D7306 = SZMMSZ5237BT1G: Zener Diode; Manufacturer: ON Semiconductor; Breakdown Voltage: 8.2V; PnP Package: SOD123; Automotive Qualified: True; Part Number: SZMMSZ5237BT1G; Part Name: SZMMSZ5237BT1G; Operating Temperature: -55°C - +150°C; ComponentLink1Description: Datasheet; ComponentLink1URL: https://www.onsemi.com/pub/Collateral/MMSZ4678T1-D.PDF; Supplier 1: Digikey; Supplier Part Number 1: SZMMSZ5237BT1GOSCT-ND; Supplier 2: Mouser; Supplier Part Number 2: 863-SZMMSZ5237BT1G
D7307 = SZMMSZ5261BT1G: Zener Diode; Manufacturer: ON Semiconductor; Breakdown Voltage: 47V; PnP Package: SOD123; Automotive Qualified: True; Part Number: SZMMSZ5261BT1G; Part Name: SZMMSZ5261BT1G; Operating Temperature: -55°C - +150°C; ComponentLink1Description: Datasheet; ComponentLink1URL: https://www.mouser.de/datasheet/2/308/MMSZ5221BT1-D-85810.pdf; Supplier 1: Digikey; Supplier Part Number 1: SZMMSZ5261BT1GOSCT-ND; Supplier 2: Mouser; Supplier Part Number 2: 863-SZMMSZ5261BT1G
Q7300 Q7301 = STL115N10F7AG: as Q7100-Q7103 on sheet buck-boost-converter; Part Number: STL115N10F7AG; Part Name: NMOS; Operating Temperature: -55°C - +175°C; ComponentLink1Description: Datasheet; ComponentLink1URL: https://www.mouser.de/datasheet/2/389/dm00333356-1798814.pdf; Supplier 1: Mouser; Supplier Part Number 1: 511-STL115N10F7AG; Supplier 2: Digikey; Supplier Part Number 2: 497-17622-1-ND; ECCN: EAR99
Q7302 = ZXTN4240F-7: Single NPN Transistor; Manufacturer: Diodes Inc.; Maximum Drain-Source Voltage: 40V; Maximum Continous Drain Current (25°C): 2A; Automotive Qualified: True; Part Number: ZXTN4240F-7; Part Name: NPN; Operating Temperature: -55°C - +150°C; ComponentLink1Description: Datasheet; ComponentLink1URL: https://www.diodes.com/assets/Datasheets/ZXTN4240F.pdf; Supplier 1: Digikey; Supplier Part Number 1: ZXTN4240F-7DICT-ND
R7301 = ERJ-MS4HF5M0U: as R7100 on sheet buck-boost-converter; Part Number: ERJ-MS4HF5M0U; Operating Temperature: -65°C - +170°C; Resistance: 0R005; Supplier 1: Digikey; Supplier Part Number 1: P17093CT-ND
R7303 = gen_R_10R_0402: as R7104 on sheet buck-boost-converter; Part Number: gen_R_10R_0402; Operating Temperature: -55°C - +155°C; Resistance: 10R; Series: E24, E96; PnP Value: 10R; Supplier 1: Farnell; Supplier Part Number 1: 2302417
R7304 R7305 R7311 = gen_R_240k_0402: SMD Resistor 240k 0402; Tolerance: 1%; Power: 0.063W; Case EIA: 0402; Case Metric: 1005; Maximum Working Voltage: 50V; PnP Package: 0402R; Automotive Qualified: True; AEC-Q Grade: Grade 0; AEC-Q Norm: AEC-Q200; Part Number: gen_R_240k_0402; Operating Temperature: -55°C - +155°C; Resistance: 240k; Series: E24; PnP Value: 240k; ECCN: EAR99; Supplier 1: Digikey; Supplier Part Number 1: P240KLCT-ND
R7306 = gen_R_33R_0402: SMD Resistor 33R 0402; Tolerance: 1%; Power: 0.063W; Case EIA: 0402; Case Metric: 1005; Maximum Working Voltage: 50V; PnP Package: 0402R; Automotive Qualified: True; AEC-Q Grade: Grade 0; AEC-Q Norm: AEC-Q200; Part Number: gen_R_33R_0402; Operating Temperature: -55°C - +155°C; Resistance: 33R; Series: E24; PnP Value: 33R; ECCN: EAR99; Supplier 1: Digikey; Supplier Part Number 1: A129609CT-ND
R7307 = gen_R_100k_0402: SMD Resistor 100k 0402; Tolerance: 1%; Power: 0.063W; Case EIA: 0402; Case Metric: 1005; Maximum Working Voltage: 50V; PnP Package: 0402R; Automotive Qualified: True; PnP equipped: x; Part Number: gen_R_100k_0402; Operating Temperature: -55°C - +155°C; Resistance: 100k; Series: E24, E96; PnP Value: 100k; Supplier 1: Farnell; Supplier Part Number 1: 2302839
R7308 R7309 = gen_R_10k_0402: as R7005 on sheet supply; Part Number: gen_R_10k_0402; Operating Temperature: -55°C - +155°C; Resistance: 10k; Series: E24, E96; PnP Value: 10k; Supplier 1: Farnell; Supplier Part Number 1: 2059239; ECCN: EAR99
R7310 = gen_R_0R_0402: SMD Resistor 0R 0402; Power: 0.063W; Case EIA: 0402; Case Metric: 1005; Maximum Working Voltage: 50V; PnP Package: 0402R; Automotive Qualified: True; AEC-Q Norm: AEC-Q200; PnP equipped: x; Part Number: gen_R_0R_0402; Operating Temperature: -55°C - +155°C; Resistance: 0R; Series: Jumper; PnP Value: 0R; Supplier 1: Farnell; Supplier Part Number 1: 1469661; Supplier 2: Farnell; Supplier Part Number 2: 2059190; ECCN: EAR99
U7300 = LTC4380HMS-4#PBF: Low Quiescent Current Surge Stopper; Manufacturer: Analog Devices; Automotive Qualified: False; Part Number: LTC4380HMS-4#PBF; Part Name: LTC4380HMS-4#PBF; Operating Temperature: −40°C - +125°C; ComponentLink1Description: Datasheet; ComponentLink1URL: https://www.analog.com/media/en/technical-documentation/data-sheets/LTC4380.pdf; Supplier 1: Digikey; Supplier Part Number 1: LTC4380HMS-4#PBF-ND

## Sheet sbcs.SchDoc
size A3; DocumentNumber: 43; SheetNumber: 43; SheetTotal: 45; SheetDescription: System basic chips for MCU and peripherals
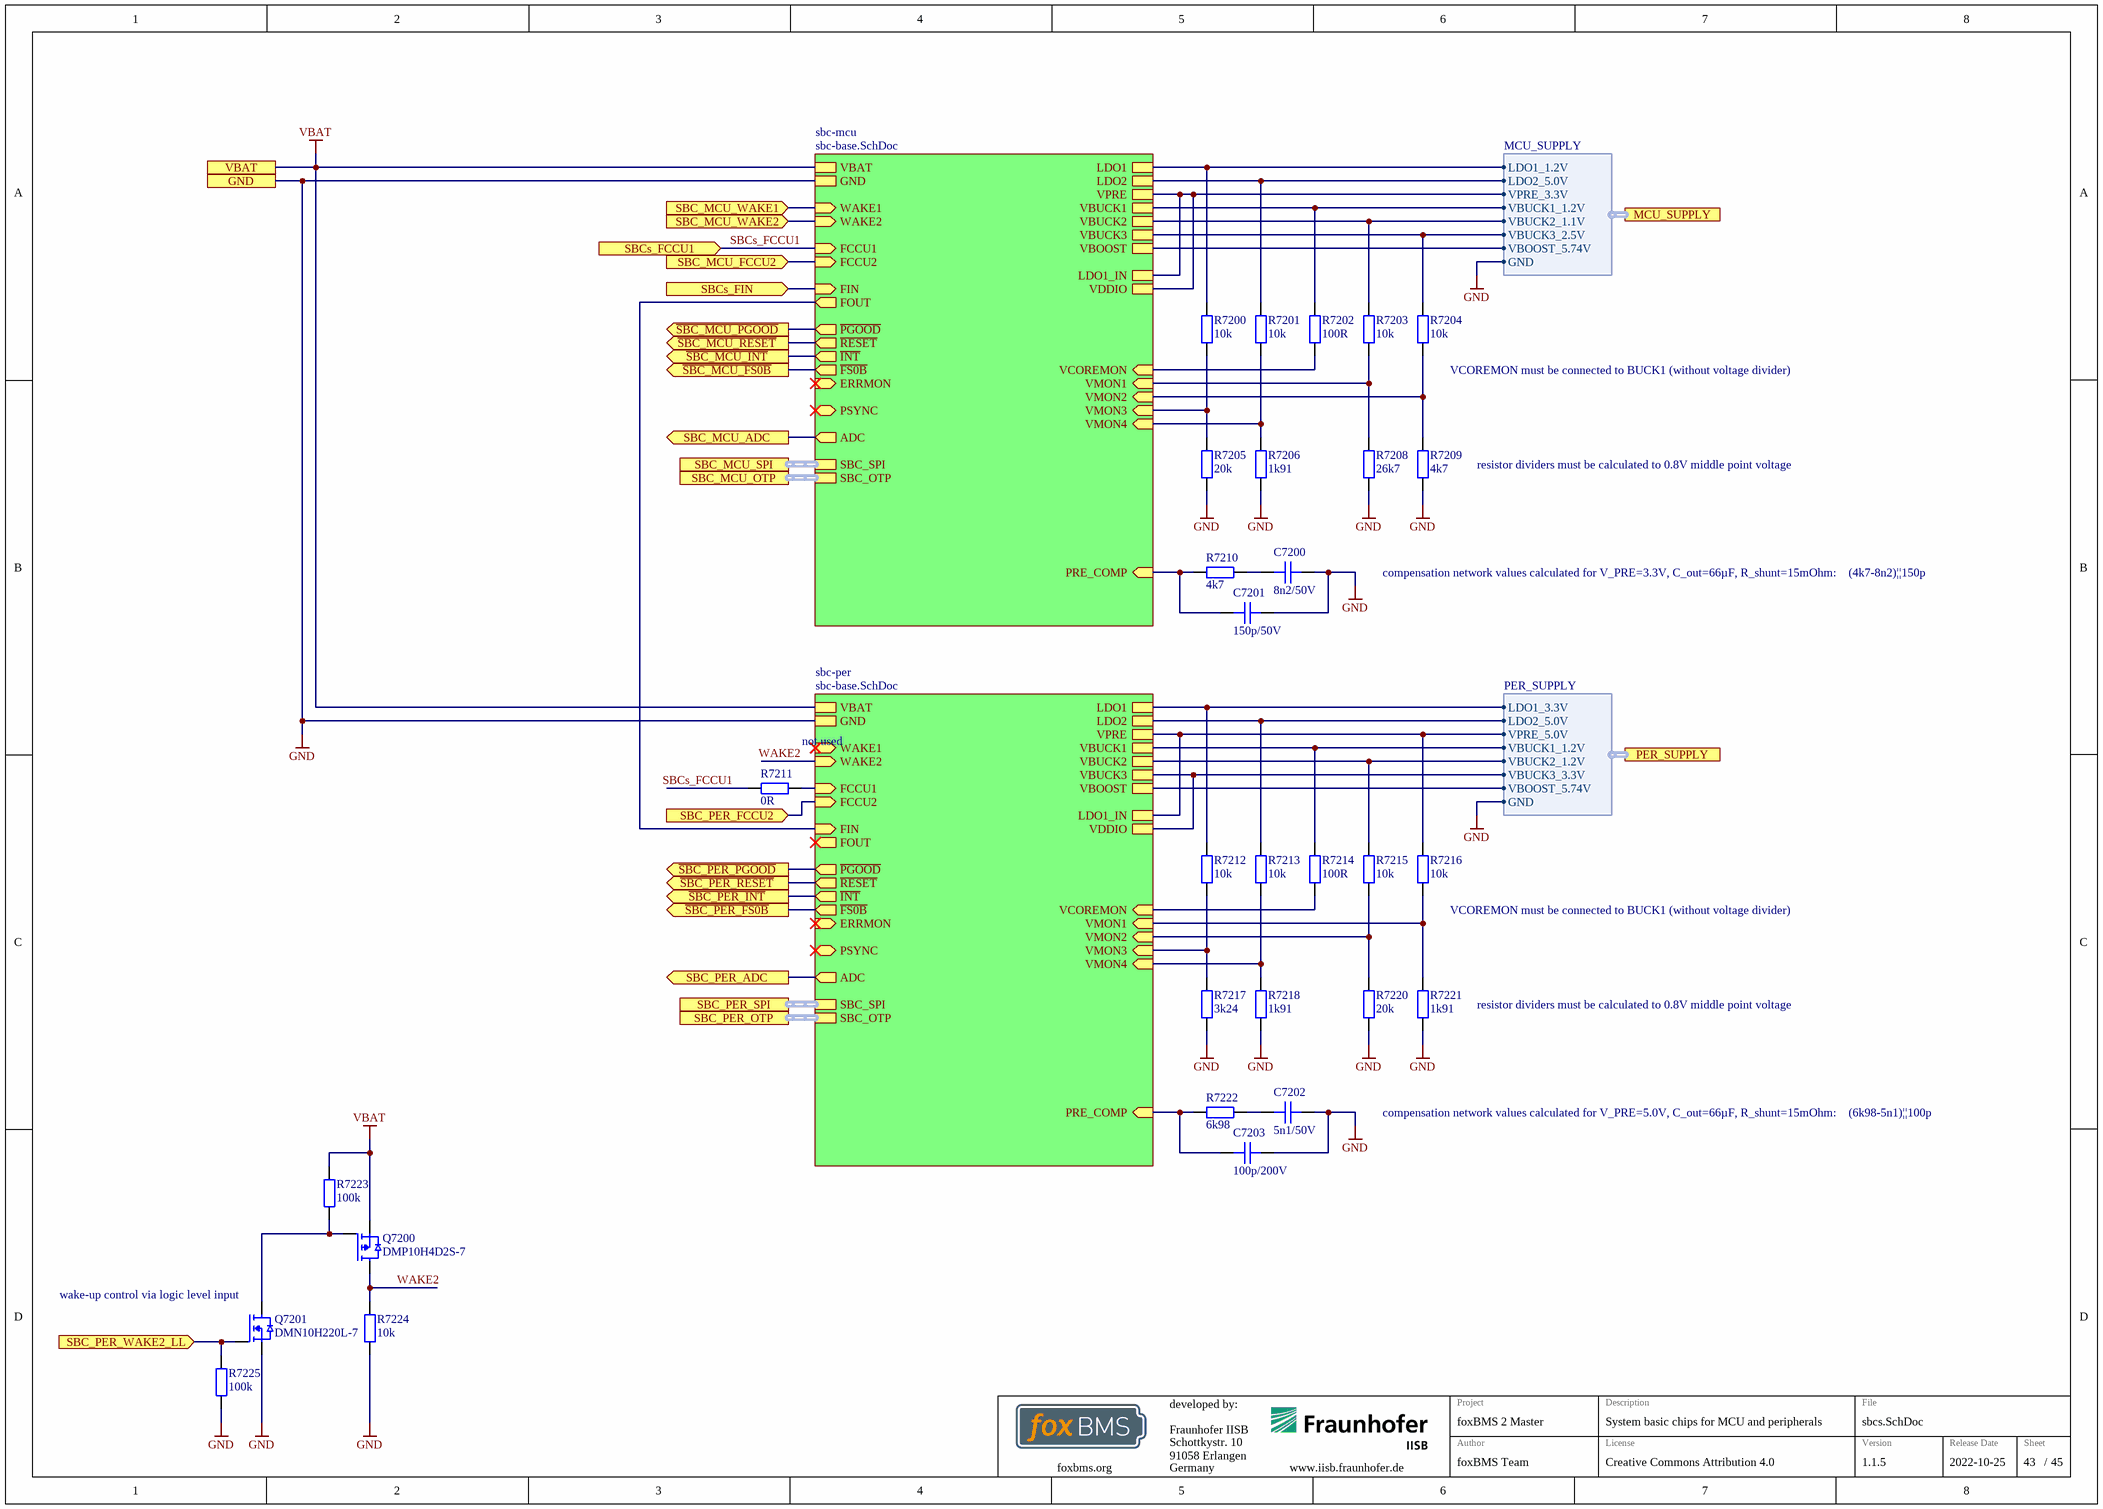
[diagram p40: sbcs.SchDoc]

### Parts
C7200  8n2/50V  [CAPC1608X08N]
C7201  150p/50V  [CAPC1005X06N]
C7202  5n1/50V  [CAPC1608X08N]
C7203  100p/200V  [CAPC1005X06N]
Q7200  DMP10H4D2S-7  [SOT95P237X110-3N]
Q7201  DMN10H220L-7  [SOT95P237X110-3N]
R7200  10k  [RESC1005X04N]
R7201  10k  [RESC1005X04N]
R7202  100R  [RESC1005X04N]
R7203  10k  [RESC1005X04N]
R7204  10k  [RESC1005X04N]
R7205  20k  [RESC1005X04N]
R7206  1k91  [RESC1005X04N]
R7208  26k7  [RESC1005X04N]
R7209  4k7  [RESC1005X04N]
R7210  4k7  [RESC1005X04N]
R7211  0R  [RESC1005X04N]
R7212  10k  [RESC1005X04N]
R7213  10k  [RESC1005X04N]
R7214  100R  [RESC1005X04N]
R7215  10k  [RESC1005X04N]
R7216  10k  [RESC1005X04N]
R7217  3k24  [RESC1005X04N]
R7218  1k91  [RESC1005X04N]
R7220  20k  [RESC1005X04N]
R7221  1k91  [RESC1005X04N]
R7222  6k98  [RESC1005X04N]
R7223  100k  [RESC1005X04N]
R7224  10k  [RESC1005X04N]
R7225  100k  [RESC1005X04N]

### Sub-sheets
sbc-mcu = sbc-base.SchDoc: ERRMON (in), FCCU1 (in), ~{FS0B} (out), ~{INT} (out), WAKE2 (in), VBAT, GND, ~{PGOOD} (out), ~{RESET} (out), FOUT (out), ADC (out), FCCU2 (in), PSYNC (bidir), SBC_OTP (harness SBC_OTP), VBUCK3, FIN (in), LDO2, VPRE, VBUCK1, VBUCK2, VCOREMON (in), VMON1 (in), VMON2 (in), VDDIO, LDO1_IN, PRE_COMP (in), VMON3 (in), VBOOST, SBC_SPI (harness SPI), LDO1, VMON4 (in), WAKE1 (in)
sbc-per = sbc-base.SchDoc: ERRMON (in), FCCU1 (in), ~{FS0B} (out), ~{INT} (out), WAKE2 (in), VBAT, GND, ~{PGOOD} (out), ~{RESET} (out), FOUT (out), ADC (out), FCCU2 (in), PSYNC (bidir), SBC_OTP (harness SBC_OTP), VBUCK3, FIN (in), LDO2, VPRE, VBUCK1, VBUCK2, VCOREMON (in), VMON1 (in), VMON2 (in), VDDIO, LDO1_IN, PRE_COMP (in), VMON3 (in), VBOOST, SBC_SPI (harness SPI), LDO1, VMON4 (in), WAKE1 (in)

### Ports
GND, MCU_SUPPLY (harness MCU_SUPPLY), PER_SUPPLY (harness PER_SUPPLY), SBC_MCU_ADC (out), SBC_MCU_FCCU2 (in), SBC_MCU_OTP (harness SBC_OTP), SBC_MCU_SPI (harness SPI), SBC_MCU_WAKE1 (in), SBC_MCU_WAKE2 (in), SBC_PER_ADC (out), SBC_PER_FCCU2 (in), SBC_PER_OTP (harness SBC_OTP), SBC_PER_SPI (harness SPI), SBC_PER_WAKE2_LL (in), SBCs_FCCU1 (in), SBCs_FIN (in), VBAT, ~{SBC_MCU_FS0B} (out), ~{SBC_MCU_INT} (out), ~{SBC_MCU_PGOOD} (out), ~{SBC_MCU_RESET} (out), ~{SBC_PER_FS0B} (out), ~{SBC_PER_INT} (out), ~{SBC_PER_PGOOD} (out), ~{SBC_PER_RESET} (out)

### Harnesses
MCU_SUPPLY: VBUCK1_1.2V, VBUCK2_1.1V, VBUCK3_2.5V, LDO1_1.2V, LDO2_5.0V, GND, VPRE_3.3V, VBOOST_5.74V
PER_SUPPLY: GND, VBOOST_5.74V, LDO1_3.3V, LDO2_5.0V, VPRE_5.0V, VBUCK1_1.2V, VBUCK2_1.2V, VBUCK3_3.3V

### Nets
GND: C7200.2 C7201.2 C7202.2 C7203.2 Q7201.S R7205.1 R7206.1 R7208.1 R7209.1 R7217.1 R7218.1 R7220.1 R7221.1 R7224.1 R7225.2 ; port GND, sheet sbc-mcu/GND, sheet sbc-per/GND, port MCU_SUPPLY.GND, port PER_SUPPLY.GND
MCU_1.1V: R7203.2 ; sheet sbc-mcu/VBUCK2, port MCU_SUPPLY.VBUCK2_1.1V
MCU_1.2V: R7202.2 ; sheet sbc-mcu/VBUCK1, port MCU_SUPPLY.VBUCK1_1.2V
MCU_1.2V_LDO: R7200.2 ; sheet sbc-mcu/LDO1, port MCU_SUPPLY.LDO1_1.2V
MCU_2.5V: R7204.2 ; sheet sbc-mcu/VBUCK3, port MCU_SUPPLY.VBUCK3_2.5V
MCU_3.3V: sheet sbc-mcu/VPRE, sheet sbc-mcu/VDDIO, sheet sbc-mcu/LDO1_IN, port MCU_SUPPLY.VPRE_3.3V
MCU_5.0V_LDO: R7201.2 ; sheet sbc-mcu/LDO2, port MCU_SUPPLY.LDO2_5.0V
MCU_5.74V: sheet sbc-mcu/VBOOST, port MCU_SUPPLY.VBOOST_5.74V
PER_1.2V_0: R7214.2 ; sheet sbc-per/VBUCK1, port PER_SUPPLY.VBUCK1_1.2V
PER_1.2V_1: R7215.2 ; sheet sbc-per/VBUCK2, port PER_SUPPLY.VBUCK2_1.2V
PER_3.3V: sheet sbc-per/VBUCK3, sheet sbc-per/VDDIO, port PER_SUPPLY.VBUCK3_3.3V
PER_3.3V_LDO: R7212.2 ; sheet sbc-per/LDO1, port PER_SUPPLY.LDO1_3.3V
PER_5.0V: R7216.2 ; sheet sbc-per/VPRE, sheet sbc-per/LDO1_IN, port PER_SUPPLY.VPRE_5.0V
PER_5.0V_LDO: R7213.2 ; sheet sbc-per/LDO2, port PER_SUPPLY.LDO2_5.0V
PER_5.74V: sheet sbc-per/VBOOST, port PER_SUPPLY.VBOOST_5.74V
VBAT: Q7200.S R7223.1 ; port VBAT, sheet sbc-mcu/VBAT, sheet sbc-per/VBAT  [project net VSUP_30]
COM_IO.INH: port SBC_MCU_WAKE1, sheet sbc-mcu/WAKE1
EXT_CON~{.}SBC_MCU_PGOOD: port ~{SBC_MCU_PGOOD}, sheet sbc-mcu/~{PGOOD}
EXT_CON~{.}SBC_MCU_RESET: port ~{SBC_MCU_RESET}, sheet sbc-mcu/~{RESET}
EXT_CON~{.}SBC_PER_PGOOD: port ~{SBC_PER_PGOOD}, sheet sbc-per/~{PGOOD}
EXT_CON~{.}SBC_PER_RESET: port ~{SBC_PER_RESET}, sheet sbc-per/~{RESET}
EXT_CON.SBC_MCU_FS0B: port ~{SBC_MCU_FS0B}, sheet sbc-mcu/~{FS0B}
EXT_CON.SBC_PER_FS0B: port ~{SBC_PER_FS0B}, sheet sbc-per/~{FS0B}
MCU_CLK.2.22MHz: port SBCs_FIN, sheet sbc-mcu/FIN
MCU_GIOA.0: port ~{SBC_MCU_INT}, sheet sbc-mcu/~{INT}
MCU_GIOA.1: port ~{SBC_PER_INT}, sheet sbc-per/~{INT}
MCU_GIOX.N4: Q7201.G R7225.1 ; port SBC_PER_WAKE2_LL
MCU_GIOX.T7: port SBC_MCU_FCCU2, sheet sbc-mcu/FCCU2
MCU_GIOX.T8: port SBC_PER_FCCU2, sheet sbc-per/FCCU2
PER_IO~{.}RTC_INTA_HV: port SBC_MCU_WAKE2, sheet sbc-mcu/WAKE2
SBCs_FCCU1: R7211.1 ; port SBCs_FCCU1, sheet sbc-mcu/FCCU1  [project net MCU_RST~{.}ERROR]
SUPPLY_IO.SBC_MCU_ADC: port SBC_MCU_ADC, sheet sbc-mcu/ADC
SUPPLY_IO.SBC_PER_ADC: port SBC_PER_ADC, sheet sbc-per/ADC
VCOREMON: R7202.1 ; sheet sbc-mcu/VCOREMON
VCOREMON: R7214.1 ; sheet sbc-per/VCOREMON  [a separate net that carries the same name]
VMON1: R7203.1 R7208.2 ; sheet sbc-mcu/VMON1
VMON1: R7216.1 R7221.2 ; sheet sbc-per/VMON1  [a separate net that carries the same name]
VMON2: R7204.1 R7209.2 ; sheet sbc-mcu/VMON2
VMON2: R7215.1 R7220.2 ; sheet sbc-per/VMON2  [a separate net that carries the same name]
VMON3: R7200.1 R7205.2 ; sheet sbc-mcu/VMON3
VMON3: R7212.1 R7217.2 ; sheet sbc-per/VMON3  [a separate net that carries the same name]
VMON4: R7201.1 R7206.2 ; sheet sbc-mcu/VMON4
VMON4: R7213.1 R7218.2 ; sheet sbc-per/VMON4  [a separate net that carries the same name]
WAKE2: Q7200.D R7224.2 ; sheet sbc-per/WAKE2
NetC7200_1: C7200.1 R7210.1
NetC7201_1: C7201.1 R7210.2 ; sheet sbc-mcu/PRE_COMP
NetC7202_1: C7202.1 R7222.1
NetC7203_1: C7203.1 R7222.2 ; sheet sbc-per/PRE_COMP
NetQ7200_G: Q7200.G Q7201.D R7223.2
NetR7211_2: R7211.2 ; sheet sbc-per/FCCU1
NetR7251_2_1: sheet sbc-mcu/FOUT, sheet sbc-per/FIN

### Buses and harness runs
harness port SBC_MCU_OTP = sheet sbc-mcu/SBC_OTP
harness port SBC_MCU_SPI = sheet sbc-mcu/SBC_SPI
harness port SBC_PER_OTP = sheet sbc-per/SBC_OTP
harness port SBC_PER_SPI = sheet sbc-per/SBC_SPI

### Notes on the sheet
- (near R7204) VCOREMON must be connected to BUCK1 (without voltage divider)
- resistor dividers must be calculated to 0.8V middle point voltage
- compensation network values calculated for V_PRE=3.3V, C_out=66µF, R_shunt=15mOhm:
- (4k7-8n2)||150p
- (near R7211) not used
- (near R7216) VCOREMON must be connected to BUCK1 (without voltage divider)
- compensation network values calculated for V_PRE=5.0V, C_out=66µF, R_shunt=15mOhm:
- (6k98-5n1)||100p
- (near Q7201) wake-up control via logic level input
- Fraunhofer IISB
- Schottkystr. 10
- developed by:
- 91058 Erlangen
- Germany
- Author
- Project
- License
- Description
- File
- Version
- Release Date
- Sheet
- foxbms.org <https://foxbms.org>
- www.iisb.fraunhofer.de <https://www.iisb.fraunhofer.de/>
- foxBMS Team
- /

### Library data of the parts
C7200 = gen_C_ceramic_8n2_50V_C0G_0603: MLCC; Capacitance: 8n2; Rated Voltage: 50V; Dielectric: C0G; Case EIA: 0603; Case Metric: 1608; Automotive Qualified: True; PnP Package: 0603C; Part Number: gen_C_ceramic_8n2_50V_C0G_0603; Supplier 1: Digikey; Supplier Part Number 1: 445-8114-1-ND
C7201 = gen_C_ceramic_150p_50V_C0G_0402: as C7118 on sheet buck-boost-converter; Part Number: gen_C_ceramic_150p_50V_C0G_0402; Supplier 1: Digikey; Supplier Part Number 1: 490-4926-1-ND
C7202 = gen_C_ceramic_5n1_50V_C0G_0603: MLCC; Capacitance: 5n1; Rated Voltage: 50V; Dielectric: C0G; Case EIA: 0603; Case Metric: 1608; Automotive Qualified: True; PnP Package: 0603C; Part Number: gen_C_ceramic_5n1_50V_C0G_0603; Supplier 1: Digikey; Supplier Part Number 1: 399-20395-1-ND
C7203 = gen_C_ceramic_100p_200V_C0G_0402: MLCC; Capacitance: 100p; Rated Voltage: 200V; Dielectric: C0G; Case EIA: 0402; Case Metric: 1005; Automotive Qualified: True; Tolerance: 5%; PnP Package: 0402C; Part Number: gen_C_ceramic_100p_200V_C0G_0402; Supplier 1: Farnell; Supplier Part Number 1: 2426878; Supplier 2: Digikey; Supplier Part Number 2: 399-11551-1-ND; Supplier 3: RS Components; Supplier Part Number 3: 8353949
Q7200 = DMP10H4D2S-7: MOSFET-Transistor, p-Kanal, 0.27 A, 100 V, 4.2 ohm; Manufacturer: Diodes; Maximum Drain-Source Voltage: 100V; Maximum Continous Drain Current (25°C): 0.27A; R_DS(on): 4.2; Total Gate Charge: 1.8nC; Automotive Qualified: True; Part Number: DMP10H4D2S-7; Part Name: PMOS; Operating Temperature: -55°C - +150°C; ComponentLink1Description: Datasheet; ComponentLink1URL: https://www.diodes.com/assets/Datasheets/DMP10H4D2S.pdf; Supplier 1: Farnell; Supplier Part Number 1: 3127354; Supplier 2: Digikey; Supplier Part Number 2: DMP10H4D2S-7DICT-ND; Supplier 3: Mouser; Supplier Part Number 3: 621-DMP10H4D2S-7
Q7201 = DMN10H220L-7: MOSFET-Transistor, n-Kanal, 1.6 A, 100 V, 0.250 ohm; Manufacturer: Diodes; Maximum Drain-Source Voltage: 100V; Maximum Continous Drain Current (25°C): 1.6A; R_DS(on): 250m; Total Gate Charge: 4.1nC; Automotive Qualified: True; Part Number: DMN10H220L-7; Part Name: NMOS; Operating Temperature: -55°C - +150°C; ComponentLink1Description: Datasheet; ComponentLink1URL: https://www.diodes.com/assets/Datasheets/DMN10H220L.pdf; Supplier 1: Digikey; Supplier Part Number 1: DMN10H220L-7DICT-ND; Supplier 2: Farnell; Supplier 3: Mouser; Supplier Part Number 2: 3127326; Supplier Part Number 3: 621-DMN10H220L-7
R7200 R7201 R7203 R7204 R7212 R7213 R7215 R7216 = gen_R_10k_0402: SMD Resistor 10k 0402; Tolerance: 1%; Power: 0.063W; Case EIA: 0402; Case Metric: 1005; Maximum Working Voltage: 50V; PnP Package: 0402R; Automotive Qualified: True; PnP equipped: x; AEC-Q Norm: AEC-Q200; Part Number: gen_R_10k_0402; Operating Temperature: -55°C - +155°C; Resistance: 10k; Series: E24, E96; PnP Value: 10k; Supplier 1: Farnell; Supplier Part Number 1: 2059239; ECCN: EAR99
R7202 R7214 = gen_R_100R_0402: SMD Resistor 100R 0402; Tolerance: 1%; Power: 0.063W; Case EIA: 0402; Case Metric: 1005; Maximum Working Voltage: 50V; PnP Package: 0402R; Automotive Qualified: True; PnP equipped: x; AEC-Q Norm: AEC-Q200; Part Number: gen_R_100R_0402; Operating Temperature: -55°C - +155°C; Resistance: 100R; Series: E24, E96; PnP Value: 100R; Supplier 1: Farnell; Supplier Part Number 1: 2302528; ECCN: EAR99
R7205 R7220 = gen_R_20k_0402: SMD Resistor 20k 0402; Tolerance: 1%; Power: 0.063W; Case EIA: 0402; Case Metric: 1005; Maximum Working Voltage: 50V; PnP Package: 0402R; Automotive Qualified: True; PnP equipped: x; AEC-Q Norm: AEC-Q200; Part Number: gen_R_20k_0402; Operating Temperature: -55°C - +155°C; Resistance: 20k; Series: E24, E96; PnP Value: 20k; Supplier 1: Farnell; Supplier Part Number 1: 2059242; Supplier 2: Farnell; Supplier Part Number 2: 2059160; ECCN: EAR99
R7206 R7218 R7221 = gen_R_1k91_0402: as R7001 on sheet supply; Part Number: gen_R_1k91_0402; Operating Temperature: -55°C - +155°C; Resistance: 1k91; Series: E96; PnP Value: 1k91; ECCN: EAR99; Supplier 1: Digikey; Supplier Part Number 1: P1.91KLCT-ND
R7208 = gen_R_26k7_0402: SMD Resistor 26k7 0402; Tolerance: 1%; Power: 0.063W; Case EIA: 0402; Case Metric: 1005; Maximum Working Voltage: 50V; PnP Package: 0402R; Automotive Qualified: True; AEC-Q Grade: Grade 0; AEC-Q Norm: AEC-Q200; Part Number: gen_R_26k7_0402; Operating Temperature: -55°C - +155°C; Resistance: 26k7; Series: E96; PnP Value: 26k7; ECCN: EAR99; Supplier 1: Digikey; Supplier Part Number 1: P26.7KLCT-ND
R7209 R7210 = gen_R_4k7_0402: as R7114 on sheet buck-boost-converter; Part Number: gen_R_4k7_0402; Operating Temperature: -55°C - +155°C; Resistance: 4k7; Series: E24; PnP Value: 4k7; Supplier 1: Farnell; Supplier Part Number 1: 2302707
R7211 = gen_R_0R_0402: as R7310 on sheet supply-protection; Part Number: gen_R_0R_0402; Operating Temperature: -55°C - +155°C; Resistance: 0R; Series: Jumper; PnP Value: 0R; Supplier 1: Farnell; Supplier Part Number 1: 1469661; Supplier 2: Farnell; Supplier Part Number 2: 2059190; ECCN: EAR99
R7217 = gen_R_3k24_0402: SMD Resistor 3k24 0402; Tolerance: 1%; Power: 0.063W; Case EIA: 0402; Case Metric: 1005; Maximum Working Voltage: 50V; PnP Package: 0402R; Automotive Qualified: True; AEC-Q Grade: Grade 0; AEC-Q Norm: AEC-Q200; Part Number: gen_R_3k24_0402; Operating Temperature: -55°C - +155°C; Resistance: 3k24; Series: E96; PnP Value: 3k24; ECCN: EAR99; Supplier 1: Farnell; Supplier Part Number 1: 2302689
R7222 = gen_R_6k98_0402: SMD Resistor 6k98 0402; Tolerance: 1%; Power: 0.063W; Case EIA: 0402; Case Metric: 1005; Maximum Working Voltage: 50V; PnP Package: 0402R; Automotive Qualified: True; AEC-Q Grade: Grade 0; AEC-Q Norm: AEC-Q200; Part Number: gen_R_6k98_0402; Operating Temperature: -55°C - +155°C; Resistance: 6k98; Series: E96; PnP Value: 6k98; ECCN: EAR99; Supplier 1: Farnell; Supplier Part Number 1: 2302725
R7223 R7225 = gen_R_100k_0402: SMD Resistor 100k 0402; Tolerance: 1%; Power: 0.063W; Case EIA: 0402; Case Metric: 1005; Maximum Working Voltage: 50V; PnP Package: 0402R; PnP equipped: x; Automotive Qualified: True; Part Number: gen_R_100k_0402; Operating Temperature: -55°C - +155°C; Resistance: 100k; Series: E24, E96; PnP Value: 100k; Supplier 1: Farnell; Supplier Part Number 1: 2302839
R7224 = gen_R_10k_0402: as R7005 on sheet supply; Part Number: gen_R_10k_0402; Operating Temperature: -55°C - +155°C; Resistance: 10k; Series: E24, E96; PnP Value: 10k; Supplier 1: Farnell; Supplier Part Number 1: 2059239; ECCN: EAR99